# Altium schematic sheet JLink_ARM-OB_Sch.SchDoc: Jlink_ARM-OB
size 177 x 127 mm; Author: Hom; CompanyName: KitSprout; DrawnBy: Hom; Engineer: Hom; Organization: KitSprout; Revision: A; SheetNumber: 1; SheetTotal: 1; Version: 2.2; LibVersion: 1.1
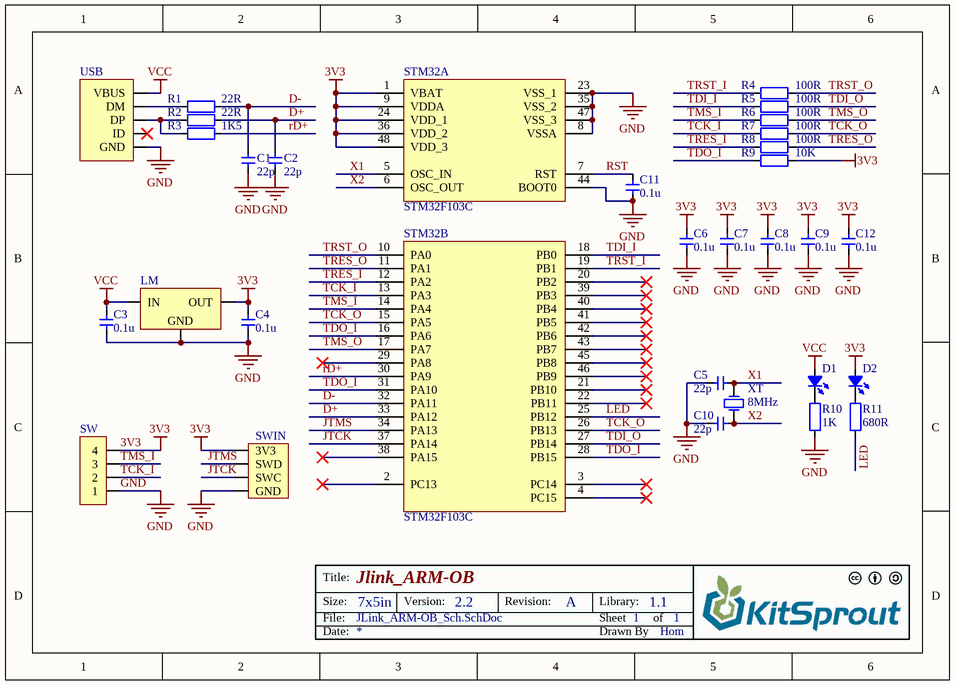
[diagram p0: JLink_ARM-OB_Sch.SchDoc]

## Parts
C1  value 22p  [CAP_0603]  (hidden comment: Cap_0603)
C2  value 22p  [CAP_0603]  (hidden comment: Cap_0603)
C3  value 0.1u  [CAP_0603]  (hidden comment: Cap_0603)
C4  value 0.1u  [CAP_0603]  (hidden comment: Cap_0603)
C5  value 22p  [CAP_0603]  (hidden comment: Cap_0603)
C6  value 0.1u  [CAP_0603]  (hidden comment: Cap_0603)
C7  value 0.1u  [CAP_0603]  (hidden comment: Cap_0603)
C8  value 0.1u  [CAP_0603]  (hidden comment: Cap_0603)
C9  value 0.1u  [CAP_0603]  (hidden comment: Cap_0603)
C10  value 22p  [CAP_0603]  (hidden comment: Cap_0603)
C11  value 0.1u  [CAP_0603]  (hidden comment: Cap_0603)
C12  value 0.1u  [CAP_0603]  (hidden comment: Cap_0603)
D1  LED_0603  [LED_0603_BLUE]  (value not drawn)
D2  LED_0603  [LED_0603_GREEN]  (value not drawn)
LM  AMS1117  [SOT223]  (value not drawn)
R1  value 22R  [RES_0603]  (hidden comment: Res_0603)
R2  value 22R  [RES_0603]  (hidden comment: Res_0603)
R3  value 1K5  [RES_0603]  (hidden comment: Res_0603)
R4  value 100R  [RES_0603]  (hidden comment: Res_0603)
R5  value 100R  [RES_0603]  (hidden comment: Res_0603)
R6  value 100R  [RES_0603]  (hidden comment: Res_0603)
R7  value 100R  [RES_0603]  (hidden comment: Res_0603)
R8  value 100R  [RES_0603]  (hidden comment: Res_0603)
R9  value 10K  [RES_0603]  (hidden comment: Res_0603)
R10  value 1K  [RES_0603]  (hidden comment: Res_0603)
R11  value 680R  [RES_0603]  (hidden comment: Res_0603)
STM32  STM32F103C  [STM32_QFP48]  (parts A,B of 2)
SW  HDR1X4_90_2.54  [HDR1X4_90_2.54]  (value not drawn)
SWIN  Pad1X4_1.27_SWD  [Pad1X4_1.27]  (value not drawn)
USB  USB_Micro  [USB_Micro-AB]  (value not drawn)
XT  value 8MHz  [XT_5032_2]  (hidden comment: XTAL_5032_2P)

## Nets
3V3: C4.2 C6.1 C7.1 C8.1 C9.1 C12.1 D2.1(A) LM.2(OUT) R9.2 STM32.1(VBAT) STM32.9(VDDA) STM32.24(VDD_1) STM32.36(VDD_2) STM32.48(VDD_3) SW.4 SWIN.1(3V3)
GND: C1.1 C2.1 C3.1 C4.1 C5.2 C6.2 C7.2 C8.2 C9.2 C10.2 C11.2 C12.2 LM.1(GND) R10.1 STM32.8(VSSA) STM32.23(VSS_1) STM32.35(VSS_2) STM32.44(BOOT0) STM32.47(VSS_3) SW.1 SWIN.4(GND) USB.5(GND)
VCC: C3.2 D1.1(A) LM.3(IN) USB.1(VBUS)
D+: C2.2 R2.2 STM32.33(PA12)
D-: C1.2 R1.2 STM32.32(PA11)
JTCK: STM32.37(PA14) SWIN.3(SWC)
JTMS: STM32.34(PA13) SWIN.2(SWD)
LED: R11.1 STM32.25(PB12)
rD+: R3.2 STM32.30(PA9)
RST: C11.1 STM32.7(RST)
TCK_I: R7.1 STM32.13(PA3) SW.2
TCK_O: R7.2 STM32.15(PA5) STM32.26(PB13)
TDI_I: R5.1 STM32.18(PB0)
TDI_O: R5.2 STM32.27(PB14)
TDO_I: R9.1 STM32.16(PA6) STM32.28(PB15) STM32.31(PA10)
TMS_I: R6.1 STM32.14(PA4) SW.3
TMS_O: R6.2 STM32.17(PA7)
TRES_I: R8.1 STM32.12(PA2)
TRES_O: R8.2 STM32.11(PA1)
TRST_I: R4.1 STM32.19(PB1)
TRST_O: R4.2 STM32.10(PA0)
X1: C5.1 STM32.5(OSC_IN) XT.2(OSC2)
X2: C10.1 STM32.6(OSC_OUT) XT.1(OSC1)
NetD1_2: D1.2(K) R10.2
NetD2_2: D2.2(K) R11.2
NetR1_1: R1.1 USB.2(DM)
NetR2_1: R2.1 R3.1 USB.3(DP)

Not connected (* = marked no-connect by the designer): STM32 2(PC13)* 3(PC14)* 4(PC15)* 20(PB2)* 21(PB10)* 22(PB11)* 29(PA8)* 38(PA15)* 39(PB3)* 40(PB4)* 41(PB5)* 42(PB6)* 43(PB7)* 45(PB8)* 46(PB9)*; USB 4(ID)*

## Notes on the sheet
- Title:
- Size:
- Date:
- File:
- 7x5in
- Version:
- Revision:
- Sheet
- Drawn By
- Library:
- of

## Library data of the parts
C1-C12 = Cap_0603: Capacitor
D1 D2 = LED_0603: LED
LM = AMS1117: Power
R1-R11 = Res_0603: Resistor
STM32 = STM32F103C: MCU
SW = HDR1X4_90_2.54: Header
SWIN = Pad1X4_1.27_SWD: Header
USB = USB_Micro: USB
XT = XTAL_5032_2P: Crystal Oscillator